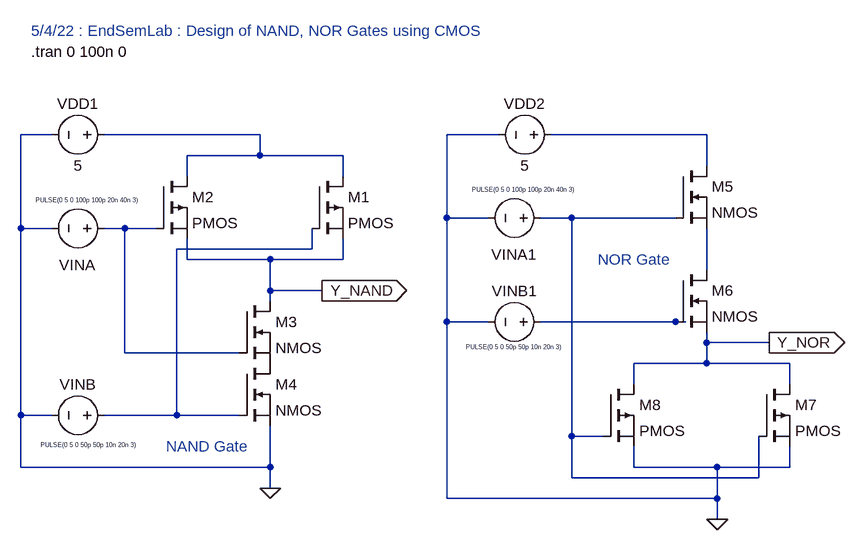
[diagram p0: schematic Draft1.asc]
Draft1.asc, the LTspice schematic file:
Version 4
SHEET 1 1084 788
WIRE -160 96 -208 96
WIRE 160 96 -80 96
WIRE 528 96 448 96
WIRE 848 96 608 96
WIRE 160 128 160 96
WIRE 160 128 48 128
WIRE 288 128 160 128
WIRE 848 144 848 96
WIRE 48 160 48 128
WIRE 288 160 288 128
WIRE 448 224 448 96
WIRE 512 224 448 224
WIRE 640 224 592 224
WIRE 800 224 640 224
WIRE -208 240 -208 96
WIRE -160 240 -208 240
WIRE -48 240 -80 240
WIRE 0 240 -48 240
WIRE 240 272 240 240
WIRE 240 272 32 272
WIRE 48 288 48 256
WIRE 176 288 48 288
WIRE 288 288 288 256
WIRE 288 288 176 288
WIRE 848 304 848 240
WIRE 176 336 176 288
WIRE 256 336 176 336
WIRE 176 352 176 336
WIRE 448 384 448 224
WIRE 512 384 448 384
WIRE 800 384 592 384
WIRE 816 384 800 384
WIRE 848 416 848 400
WIRE 944 416 848 416
WIRE -48 432 -48 240
WIRE 128 432 -48 432
WIRE 848 448 848 416
WIRE 848 448 736 448
WIRE 976 448 848 448
WIRE 736 480 736 448
WIRE 976 480 976 448
WIRE -208 528 -208 240
WIRE -160 528 -208 528
WIRE 32 528 32 272
WIRE 32 528 -80 528
WIRE 128 528 32 528
WIRE 640 560 640 224
WIRE 688 560 640 560
WIRE -208 608 -208 528
WIRE 176 608 176 544
WIRE 176 608 -208 608
WIRE 736 608 736 576
WIRE 864 608 736 608
WIRE 976 608 976 576
WIRE 976 608 864 608
WIRE 640 624 640 560
WIRE 928 624 928 560
WIRE 928 624 640 624
WIRE 176 640 176 608
WIRE 448 656 448 384
WIRE 864 656 864 608
WIRE 864 656 448 656
WIRE 864 688 864 656
FLAG 176 640 0
FLAG 256 336 Y_NAND
IOPIN 256 336 Out
FLAG 864 688 0
FLAG 944 416 Y_NOR
IOPIN 944 416 Out
SYMBOL voltage -64 96 R90
WINDOW 0 -32 56 VBottom 2
WINDOW 3 32 56 VTop 2
WINDOW 123 0 0 Left 0
WINDOW 39 0 0 Left 0
SYMATTR InstName VDD1
SYMATTR Value 5
SYMBOL pmos 240 160 R0
SYMATTR InstName M1
SYMBOL pmos 0 160 R0
SYMATTR InstName M2
SYMBOL nmos 128 352 R0
SYMATTR InstName M3
SYMBOL nmos 128 448 R0
SYMATTR InstName M4
SYMBOL voltage -64 240 R90
WINDOW 0 72 57 VBottom 2
WINDOW 3 -50 41 VTop 0
WINDOW 123 0 0 Left 0
WINDOW 39 0 0 Left 0
SYMATTR InstName VINA
SYMATTR Value PULSE(0 5 0 100p 100p 20n 40n 3)
SYMBOL voltage -64 528 R90
WINDOW 0 -32 56 VBottom 2
WINDOW 3 39 39 VTop 0
WINDOW 123 0 0 Left 0
WINDOW 39 0 0 Left 0
SYMATTR InstName VINB
SYMATTR Value PULSE(0 5 0 50p 50p 10n 20n 3)
SYMBOL voltage 624 96 R90
WINDOW 0 -32 56 VBottom 2
WINDOW 3 32 56 VTop 2
WINDOW 123 0 0 Left 0
WINDOW 39 0 0 Left 0
SYMATTR InstName VDD2
SYMATTR Value 5
SYMBOL nmos 800 144 R0
SYMATTR InstName M5
SYMBOL nmos 800 304 R0
SYMATTR InstName M6
SYMBOL pmos 928 480 R0
SYMATTR InstName M7
SYMBOL pmos 688 480 R0
SYMATTR InstName M8
SYMBOL voltage 608 224 R90
WINDOW 0 72 57 VBottom 2
WINDOW 3 -50 41 VTop 0
WINDOW 123 0 0 Left 0
WINDOW 39 0 0 Left 0
SYMATTR InstName VINA1
SYMATTR Value PULSE(0 5 0 100p 100p 20n 40n 3)
SYMBOL voltage 608 384 R90
WINDOW 0 -32 56 VBottom 2
WINDOW 3 32 56 VTop 0
WINDOW 123 0 0 Left 0
WINDOW 39 0 0 Left 0
SYMATTR InstName VINB1
SYMATTR Value PULSE(0 5 0 50p 50p 10n 20n 3)
TEXT -192 -64 Left 2 ;5/4/22 : EndSemLab : Design of NAND, NOR Gates using CMOS
TEXT 16 576 Left 2 ;NAND Gate
TEXT 680 288 Left 2 ;NOR Gate
TEXT -192 -32 Left 2 !.tran 0 100n 0

The netlist it stands for:
* Draft1.asc
VDD1 N001 0 5
M1 N001 N005 Y_NAND Y_NAND PMOS
M2 N001 N004 Y_NAND Y_NAND PMOS
M3 Y_NAND N004 P001 P001 NMOS
M4 P001 N005 0 0 NMOS
VINA N004 0 PULSE(0 5 0 100p 100p 20n 40n 3)
VINB N005 0 PULSE(0 5 0 50p 50p 10n 20n 3)
VDD2 N002 0 5
M5 N002 N003 N006 N006 NMOS
M6 N006 N007 Y_NOR Y_NOR NMOS
M7 Y_NOR N003 0 0 PMOS
M8 Y_NOR N003 0 0 PMOS
VINA1 N003 0 PULSE(0 5 0 100p 100p 20n 40n 3)
VINB1 N007 0 PULSE(0 5 0 50p 50p 10n 20n 3)
.model NMOS NMOS
.model PMOS PMOS
.lib standard.mos
* 5/4/22 : EndSemLab : Design of NAND, NOR Gates using CMOS
* NAND Gate
* NOR Gate
.tran 0 100n 0
.backanno
.end